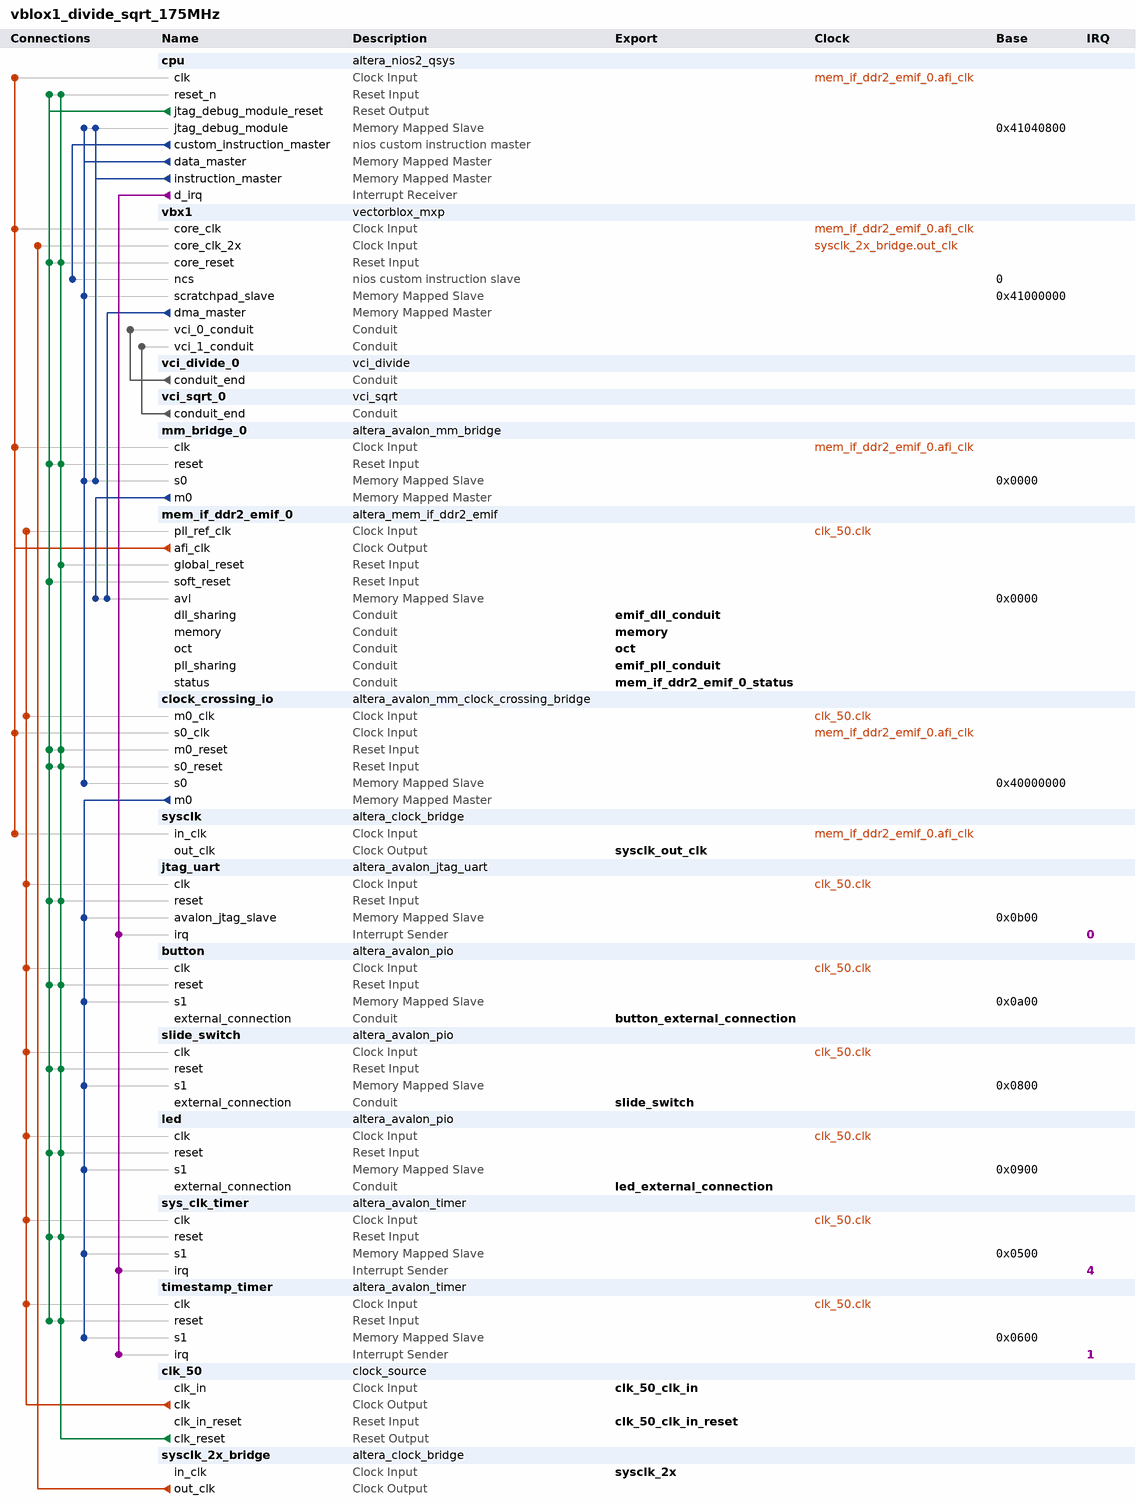
[diagram p0: system contents]
# Platform Designer (Qsys) system vblox1_divide_sqrt_175MHz, Stratix IV EP4SGX230KF40C2
# Parameters at their usual value, and those the tool derives, are not listed.
package require -exact qsys 13.1
create_system vblox1_divide_sqrt_175MHz
set_project_property DEVICE_FAMILY {Stratix IV}
set_project_property DEVICE EP4SGX230KF40C2

add_instance cpu altera_nios2_qsys 13.1
set_instance_parameter_value cpu manuallyAssignCpuID false
set_instance_parameter_value cpu resetSlave mem_if_ddr2_emif_0.avl
set_instance_parameter_value cpu exceptionSlave mem_if_ddr2_emif_0.avl
set_instance_parameter_value cpu breakSlave cpu.jtag_debug_module
set_instance_parameter_value cpu muldiv_multiplierType DSPBlock
set_instance_parameter_value cpu impl Fast
set_instance_parameter_value cpu icache_size 8192
set_instance_parameter_value cpu icache_burstType Sequential
set_instance_parameter_value cpu dcache_bursts true
set_instance_parameter_value cpu dcache_size 4096

add_instance vbx1 vectorblox_mxp 1.0
set_instance_parameter_value vbx1 VECTOR_LANES 32
set_instance_parameter_value vbx1 MEMORY_WIDTH_LANES 8
set_instance_parameter_value vbx1 BEATS_PER_BURST 4
set_instance_parameter_value vbx1 SCRATCHPAD_KB 128
set_instance_parameter_value vbx1 MIN_MULTIPLIER_HW BYTE
set_instance_parameter_value vbx1 MASK_PARTITIONS 1
set_instance_parameter_value vbx1 MAX_MASKED_WAVES 256
set_instance_parameter_value vbx1 VECTOR_CUSTOM_INSTRUCTIONS 2
set_instance_parameter_value vbx1 VCI_0_LANES 4
set_instance_parameter_value vbx1 VCI_0_OPCODE_START 0
set_instance_parameter_value vbx1 VCI_0_FUNCTIONS 1
set_instance_parameter_value vbx1 VCI_0_FUNCTION_0_DEPTH 50
set_instance_parameter_value vbx1 VCI_0_FUNCTION_1_DEPTH 0
set_instance_parameter_value vbx1 VCI_0_FUNCTION_2_DEPTH 0
set_instance_parameter_value vbx1 VCI_0_FUNCTION_3_DEPTH 0
set_instance_parameter_value vbx1 VCI_0_FUNCTION_4_DEPTH 0
set_instance_parameter_value vbx1 VCI_0_FUNCTION_5_DEPTH 0
set_instance_parameter_value vbx1 VCI_0_FUNCTION_6_DEPTH 0
set_instance_parameter_value vbx1 VCI_0_FUNCTION_7_DEPTH 0
set_instance_parameter_value vbx1 VCI_0_FUNCTION_8_DEPTH 0
set_instance_parameter_value vbx1 VCI_0_FUNCTION_9_DEPTH 0
set_instance_parameter_value vbx1 VCI_0_FUNCTION_10_DEPTH 0
set_instance_parameter_value vbx1 VCI_0_FUNCTION_11_DEPTH 0
set_instance_parameter_value vbx1 VCI_0_FUNCTION_12_DEPTH 0
set_instance_parameter_value vbx1 VCI_0_FUNCTION_13_DEPTH 0
set_instance_parameter_value vbx1 VCI_0_FUNCTION_14_DEPTH 0
set_instance_parameter_value vbx1 VCI_0_FUNCTION_15_DEPTH 0
set_instance_parameter_value vbx1 VCI_0_MODIFIES_DEST_ADDR false
set_instance_parameter_value vbx1 VCI_1_LANES 4
set_instance_parameter_value vbx1 VCI_1_OPCODE_START 1
set_instance_parameter_value vbx1 VCI_1_FUNCTIONS 1
set_instance_parameter_value vbx1 VCI_1_FUNCTION_0_DEPTH 16
set_instance_parameter_value vbx1 VCI_1_FUNCTION_1_DEPTH 0
set_instance_parameter_value vbx1 VCI_1_FUNCTION_2_DEPTH 0
set_instance_parameter_value vbx1 VCI_1_FUNCTION_3_DEPTH 0
set_instance_parameter_value vbx1 VCI_1_FUNCTION_4_DEPTH 0
set_instance_parameter_value vbx1 VCI_1_FUNCTION_5_DEPTH 0
set_instance_parameter_value vbx1 VCI_1_FUNCTION_6_DEPTH 0
set_instance_parameter_value vbx1 VCI_1_FUNCTION_7_DEPTH 0
set_instance_parameter_value vbx1 VCI_1_FUNCTION_8_DEPTH 0
set_instance_parameter_value vbx1 VCI_1_FUNCTION_9_DEPTH 0
set_instance_parameter_value vbx1 VCI_1_FUNCTION_10_DEPTH 0
set_instance_parameter_value vbx1 VCI_1_FUNCTION_11_DEPTH 0
set_instance_parameter_value vbx1 VCI_1_FUNCTION_12_DEPTH 0
set_instance_parameter_value vbx1 VCI_1_FUNCTION_13_DEPTH 0
set_instance_parameter_value vbx1 VCI_1_FUNCTION_14_DEPTH 0
set_instance_parameter_value vbx1 VCI_1_MODIFIES_DEST_ADDR false
set_instance_parameter_value vbx1 VCI_2_LANES 1
set_instance_parameter_value vbx1 VCI_2_OPCODE_START 2
set_instance_parameter_value vbx1 VCI_2_FUNCTIONS 1
set_instance_parameter_value vbx1 VCI_2_FUNCTION_0_DEPTH 0
set_instance_parameter_value vbx1 VCI_2_FUNCTION_1_DEPTH 0
set_instance_parameter_value vbx1 VCI_2_FUNCTION_2_DEPTH 0
set_instance_parameter_value vbx1 VCI_2_FUNCTION_3_DEPTH 0
set_instance_parameter_value vbx1 VCI_2_FUNCTION_4_DEPTH 0
set_instance_parameter_value vbx1 VCI_2_FUNCTION_5_DEPTH 0
set_instance_parameter_value vbx1 VCI_2_FUNCTION_6_DEPTH 0
set_instance_parameter_value vbx1 VCI_2_FUNCTION_7_DEPTH 0
set_instance_parameter_value vbx1 VCI_2_FUNCTION_8_DEPTH 0
set_instance_parameter_value vbx1 VCI_2_FUNCTION_9_DEPTH 0
set_instance_parameter_value vbx1 VCI_2_FUNCTION_10_DEPTH 0
set_instance_parameter_value vbx1 VCI_2_FUNCTION_11_DEPTH 0
set_instance_parameter_value vbx1 VCI_2_FUNCTION_12_DEPTH 0
set_instance_parameter_value vbx1 VCI_2_FUNCTION_13_DEPTH 0
set_instance_parameter_value vbx1 VCI_2_MODIFIES_DEST_ADDR false
set_instance_parameter_value vbx1 VCI_3_LANES 1
set_instance_parameter_value vbx1 VCI_3_OPCODE_START 3
set_instance_parameter_value vbx1 VCI_3_FUNCTIONS 1
set_instance_parameter_value vbx1 VCI_3_FUNCTION_0_DEPTH 0
set_instance_parameter_value vbx1 VCI_3_FUNCTION_1_DEPTH 0
set_instance_parameter_value vbx1 VCI_3_FUNCTION_2_DEPTH 0
set_instance_parameter_value vbx1 VCI_3_FUNCTION_3_DEPTH 0
set_instance_parameter_value vbx1 VCI_3_FUNCTION_4_DEPTH 0
set_instance_parameter_value vbx1 VCI_3_FUNCTION_5_DEPTH 0
set_instance_parameter_value vbx1 VCI_3_FUNCTION_6_DEPTH 0
set_instance_parameter_value vbx1 VCI_3_FUNCTION_7_DEPTH 0
set_instance_parameter_value vbx1 VCI_3_FUNCTION_8_DEPTH 0
set_instance_parameter_value vbx1 VCI_3_FUNCTION_9_DEPTH 0
set_instance_parameter_value vbx1 VCI_3_FUNCTION_10_DEPTH 0
set_instance_parameter_value vbx1 VCI_3_FUNCTION_11_DEPTH 0
set_instance_parameter_value vbx1 VCI_3_FUNCTION_12_DEPTH 0
set_instance_parameter_value vbx1 VCI_3_MODIFIES_DEST_ADDR false
set_instance_parameter_value vbx1 VCI_4_LANES 1
set_instance_parameter_value vbx1 VCI_4_OPCODE_START 4
set_instance_parameter_value vbx1 VCI_4_FUNCTIONS 1
set_instance_parameter_value vbx1 VCI_4_FUNCTION_0_DEPTH 0
set_instance_parameter_value vbx1 VCI_4_FUNCTION_1_DEPTH 0
set_instance_parameter_value vbx1 VCI_4_FUNCTION_2_DEPTH 0
set_instance_parameter_value vbx1 VCI_4_FUNCTION_3_DEPTH 0
set_instance_parameter_value vbx1 VCI_4_FUNCTION_4_DEPTH 0
set_instance_parameter_value vbx1 VCI_4_FUNCTION_5_DEPTH 0
set_instance_parameter_value vbx1 VCI_4_FUNCTION_6_DEPTH 0
set_instance_parameter_value vbx1 VCI_4_FUNCTION_7_DEPTH 0
set_instance_parameter_value vbx1 VCI_4_FUNCTION_8_DEPTH 0
set_instance_parameter_value vbx1 VCI_4_FUNCTION_9_DEPTH 0
set_instance_parameter_value vbx1 VCI_4_FUNCTION_10_DEPTH 0
set_instance_parameter_value vbx1 VCI_4_FUNCTION_11_DEPTH 0
set_instance_parameter_value vbx1 VCI_4_MODIFIES_DEST_ADDR false
set_instance_parameter_value vbx1 VCI_5_LANES 1
set_instance_parameter_value vbx1 VCI_5_OPCODE_START 5
set_instance_parameter_value vbx1 VCI_5_FUNCTIONS 1
set_instance_parameter_value vbx1 VCI_5_FUNCTION_0_DEPTH 0
set_instance_parameter_value vbx1 VCI_5_FUNCTION_1_DEPTH 0
set_instance_parameter_value vbx1 VCI_5_FUNCTION_2_DEPTH 0
set_instance_parameter_value vbx1 VCI_5_FUNCTION_3_DEPTH 0
set_instance_parameter_value vbx1 VCI_5_FUNCTION_4_DEPTH 0
set_instance_parameter_value vbx1 VCI_5_FUNCTION_5_DEPTH 0
set_instance_parameter_value vbx1 VCI_5_FUNCTION_6_DEPTH 0
set_instance_parameter_value vbx1 VCI_5_FUNCTION_7_DEPTH 0
set_instance_parameter_value vbx1 VCI_5_FUNCTION_8_DEPTH 0
set_instance_parameter_value vbx1 VCI_5_FUNCTION_9_DEPTH 0
set_instance_parameter_value vbx1 VCI_5_FUNCTION_10_DEPTH 0
set_instance_parameter_value vbx1 VCI_5_MODIFIES_DEST_ADDR false
set_instance_parameter_value vbx1 VCI_6_LANES 1
set_instance_parameter_value vbx1 VCI_6_OPCODE_START 6
set_instance_parameter_value vbx1 VCI_6_FUNCTIONS 1
set_instance_parameter_value vbx1 VCI_6_FUNCTION_0_DEPTH 0
set_instance_parameter_value vbx1 VCI_6_FUNCTION_1_DEPTH 0
set_instance_parameter_value vbx1 VCI_6_FUNCTION_2_DEPTH 0
set_instance_parameter_value vbx1 VCI_6_FUNCTION_3_DEPTH 0
set_instance_parameter_value vbx1 VCI_6_FUNCTION_4_DEPTH 0
set_instance_parameter_value vbx1 VCI_6_FUNCTION_5_DEPTH 0
set_instance_parameter_value vbx1 VCI_6_FUNCTION_6_DEPTH 0
set_instance_parameter_value vbx1 VCI_6_FUNCTION_7_DEPTH 0
set_instance_parameter_value vbx1 VCI_6_FUNCTION_8_DEPTH 0
set_instance_parameter_value vbx1 VCI_6_FUNCTION_9_DEPTH 0
set_instance_parameter_value vbx1 VCI_6_MODIFIES_DEST_ADDR false
set_instance_parameter_value vbx1 VCI_7_LANES 1
set_instance_parameter_value vbx1 VCI_7_OPCODE_START 7
set_instance_parameter_value vbx1 VCI_7_FUNCTIONS 1
set_instance_parameter_value vbx1 VCI_7_FUNCTION_0_DEPTH 0
set_instance_parameter_value vbx1 VCI_7_FUNCTION_1_DEPTH 0
set_instance_parameter_value vbx1 VCI_7_FUNCTION_2_DEPTH 0
set_instance_parameter_value vbx1 VCI_7_FUNCTION_3_DEPTH 0
set_instance_parameter_value vbx1 VCI_7_FUNCTION_4_DEPTH 0
set_instance_parameter_value vbx1 VCI_7_FUNCTION_5_DEPTH 0
set_instance_parameter_value vbx1 VCI_7_FUNCTION_6_DEPTH 0
set_instance_parameter_value vbx1 VCI_7_FUNCTION_7_DEPTH 0
set_instance_parameter_value vbx1 VCI_7_FUNCTION_8_DEPTH 0
set_instance_parameter_value vbx1 VCI_7_MODIFIES_DEST_ADDR false
set_instance_parameter_value vbx1 VCI_8_LANES 1
set_instance_parameter_value vbx1 VCI_8_OPCODE_START 8
set_instance_parameter_value vbx1 VCI_8_FUNCTIONS 1
set_instance_parameter_value vbx1 VCI_8_FUNCTION_0_DEPTH 0
set_instance_parameter_value vbx1 VCI_8_FUNCTION_1_DEPTH 0
set_instance_parameter_value vbx1 VCI_8_FUNCTION_2_DEPTH 0
set_instance_parameter_value vbx1 VCI_8_FUNCTION_3_DEPTH 0
set_instance_parameter_value vbx1 VCI_8_FUNCTION_4_DEPTH 0
set_instance_parameter_value vbx1 VCI_8_FUNCTION_5_DEPTH 0
set_instance_parameter_value vbx1 VCI_8_FUNCTION_6_DEPTH 0
set_instance_parameter_value vbx1 VCI_8_FUNCTION_7_DEPTH 0
set_instance_parameter_value vbx1 VCI_8_MODIFIES_DEST_ADDR false
set_instance_parameter_value vbx1 VCI_9_LANES 1
set_instance_parameter_value vbx1 VCI_9_OPCODE_START 9
set_instance_parameter_value vbx1 VCI_9_FUNCTIONS 1
set_instance_parameter_value vbx1 VCI_9_FUNCTION_0_DEPTH 0
set_instance_parameter_value vbx1 VCI_9_FUNCTION_1_DEPTH 0
set_instance_parameter_value vbx1 VCI_9_FUNCTION_2_DEPTH 0
set_instance_parameter_value vbx1 VCI_9_FUNCTION_3_DEPTH 0
set_instance_parameter_value vbx1 VCI_9_FUNCTION_4_DEPTH 0
set_instance_parameter_value vbx1 VCI_9_FUNCTION_5_DEPTH 0
set_instance_parameter_value vbx1 VCI_9_FUNCTION_6_DEPTH 0
set_instance_parameter_value vbx1 VCI_9_MODIFIES_DEST_ADDR false
set_instance_parameter_value vbx1 VCI_10_LANES 1
set_instance_parameter_value vbx1 VCI_10_OPCODE_START 10
set_instance_parameter_value vbx1 VCI_10_FUNCTIONS 1
set_instance_parameter_value vbx1 VCI_10_FUNCTION_0_DEPTH 0
set_instance_parameter_value vbx1 VCI_10_FUNCTION_1_DEPTH 0
set_instance_parameter_value vbx1 VCI_10_FUNCTION_2_DEPTH 0
set_instance_parameter_value vbx1 VCI_10_FUNCTION_3_DEPTH 0
set_instance_parameter_value vbx1 VCI_10_FUNCTION_4_DEPTH 0
set_instance_parameter_value vbx1 VCI_10_FUNCTION_5_DEPTH 0
set_instance_parameter_value vbx1 VCI_10_MODIFIES_DEST_ADDR false
set_instance_parameter_value vbx1 VCI_11_LANES 1
set_instance_parameter_value vbx1 VCI_11_OPCODE_START 11
set_instance_parameter_value vbx1 VCI_11_FUNCTIONS 1
set_instance_parameter_value vbx1 VCI_11_FUNCTION_0_DEPTH 0
set_instance_parameter_value vbx1 VCI_11_FUNCTION_1_DEPTH 0
set_instance_parameter_value vbx1 VCI_11_FUNCTION_2_DEPTH 0
set_instance_parameter_value vbx1 VCI_11_FUNCTION_3_DEPTH 0
set_instance_parameter_value vbx1 VCI_11_FUNCTION_4_DEPTH 0
set_instance_parameter_value vbx1 VCI_11_MODIFIES_DEST_ADDR false
set_instance_parameter_value vbx1 VCI_12_LANES 1
set_instance_parameter_value vbx1 VCI_12_OPCODE_START 12
set_instance_parameter_value vbx1 VCI_12_FUNCTIONS 1
set_instance_parameter_value vbx1 VCI_12_FUNCTION_0_DEPTH 0
set_instance_parameter_value vbx1 VCI_12_FUNCTION_1_DEPTH 0
set_instance_parameter_value vbx1 VCI_12_FUNCTION_2_DEPTH 0
set_instance_parameter_value vbx1 VCI_12_FUNCTION_3_DEPTH 0
set_instance_parameter_value vbx1 VCI_12_MODIFIES_DEST_ADDR false
set_instance_parameter_value vbx1 VCI_13_LANES 1
set_instance_parameter_value vbx1 VCI_13_OPCODE_START 13
set_instance_parameter_value vbx1 VCI_13_FUNCTIONS 1
set_instance_parameter_value vbx1 VCI_13_FUNCTION_0_DEPTH 0
set_instance_parameter_value vbx1 VCI_13_FUNCTION_1_DEPTH 0
set_instance_parameter_value vbx1 VCI_13_FUNCTION_2_DEPTH 0
set_instance_parameter_value vbx1 VCI_13_MODIFIES_DEST_ADDR false
set_instance_parameter_value vbx1 VCI_14_LANES 1
set_instance_parameter_value vbx1 VCI_14_OPCODE_START 14
set_instance_parameter_value vbx1 VCI_14_FUNCTIONS 1
set_instance_parameter_value vbx1 VCI_14_FUNCTION_0_DEPTH 0
set_instance_parameter_value vbx1 VCI_14_FUNCTION_1_DEPTH 0
set_instance_parameter_value vbx1 VCI_14_MODIFIES_DEST_ADDR false
set_instance_parameter_value vbx1 VCI_15_LANES 1
set_instance_parameter_value vbx1 VCI_15_OPCODE_START 15
set_instance_parameter_value vbx1 VCI_15_FUNCTIONS 1
set_instance_parameter_value vbx1 VCI_15_FUNCTION_0_DEPTH 0
set_instance_parameter_value vbx1 VCI_15_MODIFIES_DEST_ADDR false
set_instance_parameter_value vbx1 MULFXP_WORD_FRACTION_BITS 16
set_instance_parameter_value vbx1 MULFXP_HALF_FRACTION_BITS 15
set_instance_parameter_value vbx1 MULFXP_BYTE_FRACTION_BITS 4
set_instance_parameter_value vbx1 CI_CLK_RATE 0
set_instance_parameter_value vbx1 CORE_CLK_RATE 175000000
set_instance_parameter_value vbx1 CORE_CLK_2X_RATE 350000000
set_instance_parameter_value vbx1 CI_CLK_DOMAIN 0
set_instance_parameter_value vbx1 CORE_CLK_DOMAIN 6
set_instance_parameter_value vbx1 CORE_CLK_2X_DOMAIN 3
set_instance_parameter_value vbx1 UNIQUE_ID {$${FILENAME}_vbx1}

add_instance vci_divide_0 vci_divide 1.0
set_instance_parameter_value vci_divide_0 VCI_LANES 4
set_instance_parameter_value vci_divide_0 FXP_BITS 16

add_instance vci_sqrt_0 vci_sqrt 1.0
set_instance_parameter_value vci_sqrt_0 VCI_LANES 4
set_instance_parameter_value vci_sqrt_0 FXP_BITS 16
set_instance_parameter_value vci_sqrt_0 PIPELINE_STAGES 16

add_instance mm_bridge_0 altera_avalon_mm_bridge 13.1
set_instance_parameter_value mm_bridge_0 DATA_WIDTH 256
set_instance_parameter_value mm_bridge_0 ADDRESS_WIDTH 30
set_instance_parameter_value mm_bridge_0 ADDRESS_UNITS SYMBOLS
set_instance_parameter_value mm_bridge_0 MAX_PENDING_RESPONSES 4

add_instance mem_if_ddr2_emif_0 altera_mem_if_ddr2_emif 13.1
set_instance_parameter_value mem_if_ddr2_emif_0 MEM_CLK_FREQ 350.0
set_instance_parameter_value mem_if_ddr2_emif_0 MEM_VENDOR JEDEC
set_instance_parameter_value mem_if_ddr2_emif_0 MEM_ROW_ADDR_WIDTH 14
set_instance_parameter_value mem_if_ddr2_emif_0 MEM_COL_ADDR_WIDTH 10
set_instance_parameter_value mem_if_ddr2_emif_0 MEM_DQ_WIDTH 64
set_instance_parameter_value mem_if_ddr2_emif_0 MEM_BANKADDR_WIDTH 3
set_instance_parameter_value mem_if_ddr2_emif_0 MEM_NUMBER_OF_RANKS_PER_DIMM 1
set_instance_parameter_value mem_if_ddr2_emif_0 MEM_VERBOSE false
set_instance_parameter_value mem_if_ddr2_emif_0 MEM_TCL 7
set_instance_parameter_value mem_if_ddr2_emif_0 TIMING_TIS 175
set_instance_parameter_value mem_if_ddr2_emif_0 TIMING_TIH 250
set_instance_parameter_value mem_if_ddr2_emif_0 TIMING_TDS 50
set_instance_parameter_value mem_if_ddr2_emif_0 TIMING_TDH 125
set_instance_parameter_value mem_if_ddr2_emif_0 TIMING_TDQSQ 200
set_instance_parameter_value mem_if_ddr2_emif_0 TIMING_TQHS 300
set_instance_parameter_value mem_if_ddr2_emif_0 TIMING_TDQSCK 400
set_instance_parameter_value mem_if_ddr2_emif_0 MEM_TINIT_US 499
set_instance_parameter_value mem_if_ddr2_emif_0 MEM_TMRD_CK 3
set_instance_parameter_value mem_if_ddr2_emif_0 MEM_TRAS_NS 45.0
set_instance_parameter_value mem_if_ddr2_emif_0 MEM_TRFC_NS 105.0
set_instance_parameter_value mem_if_ddr2_emif_0 MEM_TFAW_NS 35.0
set_instance_parameter_value mem_if_ddr2_emif_0 POWER_OF_TWO_BUS true
set_instance_parameter_value mem_if_ddr2_emif_0 AVL_MAX_SIZE 64
set_instance_parameter_value mem_if_ddr2_emif_0 REF_CLK_FREQ 50.0
set_instance_parameter_value mem_if_ddr2_emif_0 DEFAULT_FAST_SIM_MODEL true
set_instance_parameter_value mem_if_ddr2_emif_0 PLL_SHARING_MODE Master
set_instance_parameter_value mem_if_ddr2_emif_0 EXPORT_AFI_HALF_CLK false
set_instance_parameter_value mem_if_ddr2_emif_0 SKIP_MEM_INIT false
set_instance_parameter_value mem_if_ddr2_emif_0 CALIBRATION_MODE Full
set_instance_parameter_value mem_if_ddr2_emif_0 USER_DEBUG_LEVEL 1
set_instance_parameter_value mem_if_ddr2_emif_0 DLL_SHARING_MODE Master

add_instance clock_crossing_io altera_avalon_mm_clock_crossing_bridge 13.1
set_instance_parameter_value clock_crossing_io DATA_WIDTH 32
set_instance_parameter_value clock_crossing_io ADDRESS_WIDTH 12
set_instance_parameter_value clock_crossing_io MAX_BURST_SIZE 1
set_instance_parameter_value clock_crossing_io COMMAND_FIFO_DEPTH 2
set_instance_parameter_value clock_crossing_io RESPONSE_FIFO_DEPTH 2
set_instance_parameter_value clock_crossing_io MASTER_SYNC_DEPTH 2
set_instance_parameter_value clock_crossing_io SLAVE_SYNC_DEPTH 2

add_instance sysclk altera_clock_bridge 13.1
set_instance_parameter_value sysclk DERIVED_CLOCK_RATE 175000000
set_instance_parameter_value sysclk EXPLICIT_CLOCK_RATE 0

add_instance jtag_uart altera_avalon_jtag_uart 13.1
set_instance_parameter_value jtag_uart simInteractiveOptions INTERACTIVE_ASCII_OUTPUT

add_instance button altera_avalon_pio 13.1
set_instance_parameter_value button direction Input
set_instance_parameter_value button width 4

add_instance slide_switch altera_avalon_pio 13.1
set_instance_parameter_value slide_switch direction Input
set_instance_parameter_value slide_switch width 4

add_instance led altera_avalon_pio 13.1
set_instance_parameter_value led direction Output
set_instance_parameter_value led width 8

add_instance sys_clk_timer altera_avalon_timer 13.1
set_instance_parameter_value sys_clk_timer period 10
set_instance_parameter_value sys_clk_timer periodUnits MSEC

add_instance timestamp_timer altera_avalon_timer 13.1
set_instance_parameter_value timestamp_timer counterSize 64
set_instance_parameter_value timestamp_timer period 1
set_instance_parameter_value timestamp_timer periodUnits MSEC

add_instance clk_50 clock_source 13.1
set_instance_parameter_value clk_50 clockFrequency 50000000

add_instance sysclk_2x_bridge altera_clock_bridge 13.1
set_instance_parameter_value sysclk_2x_bridge DERIVED_CLOCK_RATE 0
set_instance_parameter_value sysclk_2x_bridge EXPLICIT_CLOCK_RATE 350000000

# connections
add_connection clk_50.clk button.clk clock
add_connection clk_50.clk clock_crossing_io.m0_clk clock
add_connection clk_50.clk jtag_uart.clk clock
add_connection clk_50.clk led.clk clock
add_connection clk_50.clk mem_if_ddr2_emif_0.pll_ref_clk clock
add_connection clk_50.clk slide_switch.clk clock
add_connection clk_50.clk sys_clk_timer.clk clock
add_connection clk_50.clk timestamp_timer.clk clock
add_connection mem_if_ddr2_emif_0.afi_clk clock_crossing_io.s0_clk clock
add_connection mem_if_ddr2_emif_0.afi_clk cpu.clk clock
add_connection mem_if_ddr2_emif_0.afi_clk mm_bridge_0.clk clock
add_connection mem_if_ddr2_emif_0.afi_clk sysclk.in_clk clock
add_connection mem_if_ddr2_emif_0.afi_clk vbx1.core_clk clock
add_connection sysclk_2x_bridge.out_clk vbx1.core_clk_2x clock
add_connection clk_50.clk_reset button.reset reset
add_connection clk_50.clk_reset clock_crossing_io.m0_reset reset
add_connection clk_50.clk_reset clock_crossing_io.s0_reset reset
add_connection clk_50.clk_reset cpu.reset_n reset
add_connection clk_50.clk_reset jtag_uart.reset reset
add_connection clk_50.clk_reset led.reset reset
add_connection clk_50.clk_reset mem_if_ddr2_emif_0.global_reset reset
add_connection clk_50.clk_reset mm_bridge_0.reset reset
add_connection clk_50.clk_reset slide_switch.reset reset
add_connection clk_50.clk_reset sys_clk_timer.reset reset
add_connection clk_50.clk_reset timestamp_timer.reset reset
add_connection clk_50.clk_reset vbx1.core_reset reset
add_connection cpu.jtag_debug_module_reset button.reset reset
add_connection cpu.jtag_debug_module_reset clock_crossing_io.m0_reset reset
add_connection cpu.jtag_debug_module_reset clock_crossing_io.s0_reset reset
add_connection cpu.jtag_debug_module_reset cpu.reset_n reset
add_connection cpu.jtag_debug_module_reset jtag_uart.reset reset
add_connection cpu.jtag_debug_module_reset led.reset reset
add_connection cpu.jtag_debug_module_reset mem_if_ddr2_emif_0.soft_reset reset
add_connection cpu.jtag_debug_module_reset mm_bridge_0.reset reset
add_connection cpu.jtag_debug_module_reset slide_switch.reset reset
add_connection cpu.jtag_debug_module_reset sys_clk_timer.reset reset
add_connection cpu.jtag_debug_module_reset timestamp_timer.reset reset
add_connection cpu.jtag_debug_module_reset vbx1.core_reset reset
add_connection clock_crossing_io.m0 button.s1 avalon
set_connection_parameter_value clock_crossing_io.m0/button.s1 baseAddress 0x0a00
add_connection clock_crossing_io.m0 jtag_uart.avalon_jtag_slave avalon
set_connection_parameter_value clock_crossing_io.m0/jtag_uart.avalon_jtag_slave baseAddress 0x0b00
add_connection clock_crossing_io.m0 led.s1 avalon
set_connection_parameter_value clock_crossing_io.m0/led.s1 baseAddress 0x0900
add_connection clock_crossing_io.m0 slide_switch.s1 avalon
set_connection_parameter_value clock_crossing_io.m0/slide_switch.s1 baseAddress 0x0800
add_connection clock_crossing_io.m0 sys_clk_timer.s1 avalon
set_connection_parameter_value clock_crossing_io.m0/sys_clk_timer.s1 baseAddress 0x0500
add_connection clock_crossing_io.m0 timestamp_timer.s1 avalon
set_connection_parameter_value clock_crossing_io.m0/timestamp_timer.s1 baseAddress 0x0600
add_connection cpu.data_master clock_crossing_io.s0 avalon
set_connection_parameter_value cpu.data_master/clock_crossing_io.s0 baseAddress 0x40000000
add_connection cpu.data_master cpu.jtag_debug_module avalon
set_connection_parameter_value cpu.data_master/cpu.jtag_debug_module baseAddress 0x41040800
add_connection cpu.data_master mm_bridge_0.s0 avalon
set_connection_parameter_value cpu.data_master/mm_bridge_0.s0 baseAddress 0x0000
add_connection cpu.data_master vbx1.scratchpad_slave avalon
set_connection_parameter_value cpu.data_master/vbx1.scratchpad_slave baseAddress 0x41000000
add_connection cpu.instruction_master cpu.jtag_debug_module avalon
set_connection_parameter_value cpu.instruction_master/cpu.jtag_debug_module baseAddress 0x41040800
add_connection cpu.instruction_master mm_bridge_0.s0 avalon
set_connection_parameter_value cpu.instruction_master/mm_bridge_0.s0 baseAddress 0x0000
add_connection mm_bridge_0.m0 mem_if_ddr2_emif_0.avl avalon
set_connection_parameter_value mm_bridge_0.m0/mem_if_ddr2_emif_0.avl baseAddress 0x0000
add_connection vbx1.dma_master mem_if_ddr2_emif_0.avl avalon
set_connection_parameter_value vbx1.dma_master/mem_if_ddr2_emif_0.avl baseAddress 0x0000
add_connection vci_divide_0.conduit_end vbx1.vci_0_conduit conduit
add_connection vci_sqrt_0.conduit_end vbx1.vci_1_conduit conduit
add_connection cpu.d_irq jtag_uart.irq interrupt
set_connection_parameter_value cpu.d_irq/jtag_uart.irq irqNumber 0
add_connection cpu.d_irq sys_clk_timer.irq interrupt
set_connection_parameter_value cpu.d_irq/sys_clk_timer.irq irqNumber 4
add_connection cpu.d_irq timestamp_timer.irq interrupt
set_connection_parameter_value cpu.d_irq/timestamp_timer.irq irqNumber 1
add_connection cpu.custom_instruction_master vbx1.ncs nios_custom_instruction
set_connection_parameter_value cpu.custom_instruction_master/vbx1.ncs CIName vectorblox_ncs_shim_0
set_connection_parameter_value cpu.custom_instruction_master/vbx1.ncs baseAddress 0

# exported interfaces
add_interface clk_50_clk_in clock sink
set_interface_property clk_50_clk_in EXPORT_OF clk_50.clk_in
add_interface button_external_connection conduit end
set_interface_property button_external_connection EXPORT_OF button.external_connection
add_interface clk_50_clk_in_reset reset sink
set_interface_property clk_50_clk_in_reset EXPORT_OF clk_50.clk_in_reset
add_interface led_external_connection conduit end
set_interface_property led_external_connection EXPORT_OF led.external_connection
add_interface sysclk_out_clk clock source
set_interface_property sysclk_out_clk EXPORT_OF sysclk.out_clk
add_interface memory conduit end
set_interface_property memory EXPORT_OF mem_if_ddr2_emif_0.memory
add_interface oct conduit end
set_interface_property oct EXPORT_OF mem_if_ddr2_emif_0.oct
add_interface mem_if_ddr2_emif_0_status conduit end
set_interface_property mem_if_ddr2_emif_0_status EXPORT_OF mem_if_ddr2_emif_0.status
add_interface sysclk_2x clock sink
set_interface_property sysclk_2x EXPORT_OF sysclk_2x_bridge.in_clk
add_interface emif_pll_conduit conduit end
set_interface_property emif_pll_conduit EXPORT_OF mem_if_ddr2_emif_0.pll_sharing
add_interface emif_dll_conduit conduit end
set_interface_property emif_dll_conduit EXPORT_OF mem_if_ddr2_emif_0.dll_sharing
add_interface slide_switch conduit end
set_interface_property slide_switch EXPORT_OF slide_switch.external_connection

set_interconnect_requirement {$system} qsys_mm.clockCrossingAdapter AUTO
set_interconnect_requirement {$system} qsys_mm.maxAdditionalLatency 2

save_system vblox1_divide_sqrt_175MHz.qsys
